# Altium schematic sheet Sheet1.SchDoc
size A; SheetNumber: 1; SheetTotal: 1
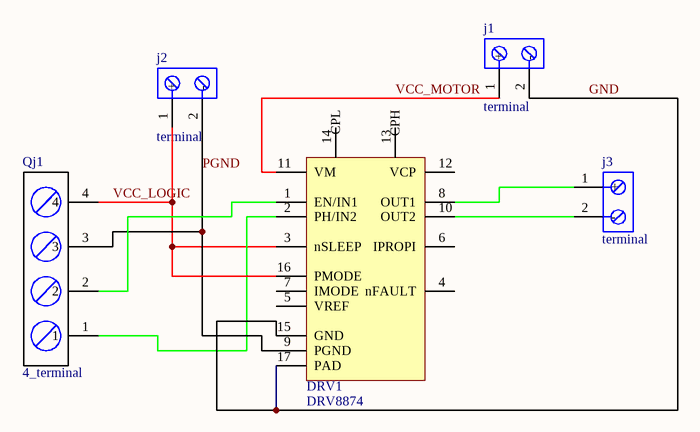
[diagram p0: Sheet1.SchDoc]

## Parts
DRV1  DRV8874  [DRV8874]
j1  terminal  [terminal]
j2  terminal  [terminal]
j3  terminal  [terminal]
Qj1  4_terminal  [4 position terminal block]

## Nets
GND: DRV1.15(GND) DRV1.17(PAD) j1.2(-)
PGND: DRV1.9(PGND) j2.2(-) Qj1.3
VCC_LOGIC: DRV1.3(nSLEEP) DRV1.16(PMODE) j2.1(+) Qj1.4
VCC_MOTOR: DRV1.11(VM) j1.1(+)
NetDRV1_1: DRV1.1(EN/IN1) Qj1.2
NetDRV1_2: DRV1.2(PH/IN2) Qj1.1
NetDRV1_8: DRV1.8(OUT1) j3.1(+)
NetDRV1_10: DRV1.10(OUT2) j3.2(-)

Not connected (* = marked no-connect by the designer): DRV1 4(nFAULT) 5(VREF) 6(IPROPI) 7(IMODE) 12(VCP) 13(CPH) 14(CPL)

## Library data of the parts
DRV1 = DRV8874QPWPRQ1: Brush DC Motor Controller, 6A, PDSO16; Manufacturer: Texas Instruments; Supplier: Digikey; Supplier Part Number: 296-DRV8874QPWPRQ1DKR-ND; Manufacturer Part Number: DRV8874QPWPRQ1; RoHS: Yes; Category: Integrated Circuits (ICs); Pricing: 1=2.89, 10=2.596, 25=2.4544, 100=2.1271, 250=2.018, 500=1.81072, 1000=1.52712 (USD); RoHS Compliant: Yes; ComponentLink1URL: https://www.ti.com:443/lit/ds/symlink/drv8874-q1.pdf?src-supplier=IHS+Markit; ComponentLink1Description: https://www.ti.com:443/lit/ds/symlink/drv8874-q1.pdf?src-supplier=IHS+Markit
j1-j3 = 691137710002: Barrier Strip Terminal Block; Manufacturer: Wurth Electronics; Supplier: Rs; Supplier Part Number: 1769908; Manufacturer Part Number: 691137710002; RoHS: No; Category: Terminal Blocks; Stock: 355; Pricing: 500=0.218, 1000=0.202, 2500=0.189 (GBP); RoHS Compliant: Yes; ComponentLink1URL: https://datasheet.ciiva.com:443/pdfs/VipMasterIC/IC/MIDC/MIDC-S-A0005074262/MIDC-S-A0004711666-1.pdf?src-supplier=IHS+Markit; ComponentLink1Description: https://datasheet.ciiva.com:443/pdfs/VipMasterIC/IC/MIDC/MIDC-S-A0005074262/MIDC-S-A0004711666-1.pdf?src-supplier=IHS+Markit; ComponentLink2URL: https://katalog.we-online.de/em/datasheet/691137710002.pdf?src-supplier=Digikey; ComponentLink2Description: https://katalog.we-online.de/em/datasheet/691137710002.pdf?src-supplier=Digikey
Qj1 = 1934887: Barrier Strip Terminal Block, 12A, 1.5mm2, 1 Row(s), 1 Deck(s); Manufacturer: Phoenix Contact; Fastening Method: SCREW; Number of Decks: 1; Number of Ways: 4; Voltage Rating: 250V; Wire/Cable Gauge: 14AWG; Safety Approval: UL; Supplier: Rs; Supplier Part Number: 4680931; Manufacturer Part Number: 1934887; RoHS: Yes; Category: Terminal Blocks; Stock: 125; Pricing: 5=1.204, 125=1.172, 375=1.14, 1000=1.108, 2000=1.08 (GBP); Mounting Technology: Board; Terminal and Terminal Block Type: BARRIER STRIP TERMINAL BLOCK; Number of Rows: 1; Current Rating: 12A; Wire Cross Section: 1.5mm2; RoHS Compliant: Yes; Reach SVHC Compliant: Yes; ComponentLink1URL: https://www.phoenixcontact.com:443/online/portal/us?uri=pxc-oc-itemdetail%3apid%3d1934887&library=usen&pcck=P-11-02-11&tab=1&src-supplier=IHS+Markit; ComponentLink1Description: https://www.phoenixcontact.com:443/online/portal/us?uri=pxc-oc-itemdetail%3apid%3d1934887&library=usen&pcck=P-11-02-11&tab=1&src-supplier=IHS+Markit; ComponentLink2URL: https://datasheet.ciiva.com/16047/1934887-16047240.pdf?src-supplier=Onlinecomponents.com; ComponentLink2Description: https://datasheet.ciiva.com/16047/1934887-16047240.pdf?src-supplier=Onlinecomponents.com; ComponentLink3URL: https://datasheet.ciiva.com/15169/getdatasheetpartid-177849-15169637.pdf?src-supplier=Verical; ComponentLink3Description: https://datasheet.ciiva.com/15169/getdatasheetpartid-177849-15169637.pdf?src-supplier=Verical; ComponentLink4URL: https://datasheet.ciiva.com/795/combiconcompact5-0mmseries-795415.pdf?src-supplier=Digikey; ComponentLink4Description: https://datasheet.ciiva.com/795/combiconcompact5-0mmseries-795415.pdf?src-supplier=Digikey; ComponentLink5URL: https://datasheet.ciiva.com/14608/70054929-14608235.pdf?src-supplier=Allied+Electronics; ComponentLink5Description: https://datasheet.ciiva.com/14608/70054929-14608235.pdf?src-supplier=Allied+Electronics; ComponentLink6URL: https://datasheet.ciiva.com/29224/744154-da-01-en-printklemme-pt-1-5-4-pvh-5-0-29224875.pdf?src-supplier=Conrad; ComponentLink6Description: https://datasheet.ciiva.com/29224/744154-da-01-en-printklemme-pt-1-5-4-pvh-5-0-29224875.pdf?src-supplier=Conrad